# EAGLE design 0119-m328p (EAGLE 9.6.2)
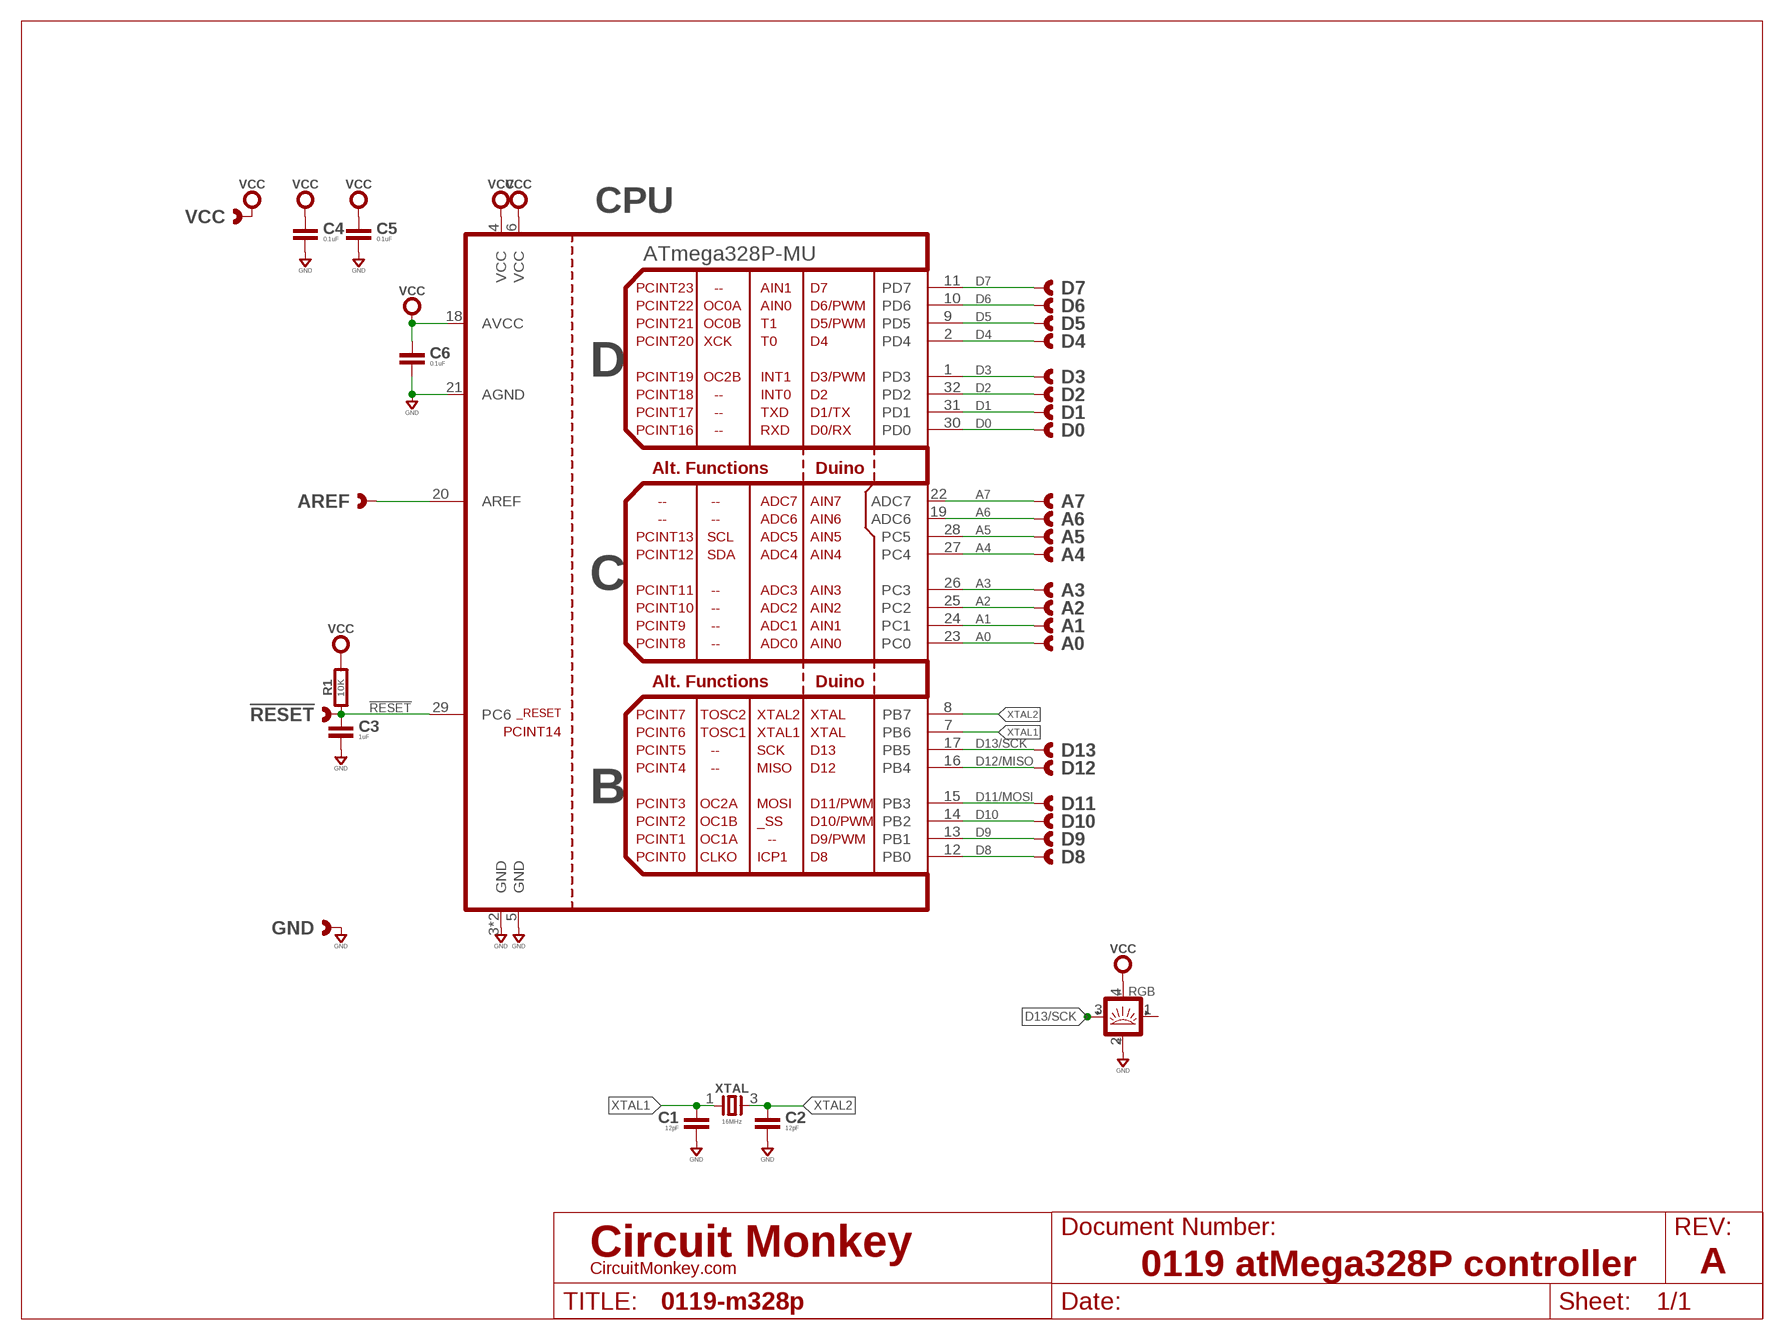
[diagram p0: schematic, sheet 1]
U$1 (LETTER_L-CIRCUITMONKEY): DOCUMENT_NUMBER: 0119 atMega328P controller; REV: A

## Parts
!RESET  CAST-01X12.00MM  [CAST01-2.00MM]
A0  CAST-01X12.00MM  [CAST01-2.00MM]
A1  CAST-01X12.00MM  [CAST01-2.00MM]
A2  CAST-01X12.00MM  [CAST01-2.00MM]
A3  CAST-01X12.00MM  [CAST01-2.00MM]
A4  CAST-01X12.00MM  [CAST01-2.00MM]
A5  CAST-01X12.00MM  [CAST01-2.00MM]
A6  CAST-01X12.00MM  [CAST01-2.00MM]
A7  CAST-01X12.00MM  [CAST01-2.00MM]
AREF  CAST-01X12.00MM  [CAST01-2.00MM]
C1  12pF  CAPACITOR0402  [0402-CAP]
C2  12pF  CAPACITOR0402  [0402-CAP]
C3  1uF  CAPACITOR0402  [0402-CAP]
C4  0.1uF  CAPACITOR0402  [0402-CAP]
C5  0.1uF  CAPACITOR0402  [0402-CAP]
C6  0.1uF  CAPACITOR0402  [0402-CAP]
CPU  ATmega328P-MU  ATMEGA328MU  [MLF32]
D0  CAST-01X12.00MM  [CAST01-2.00MM]
D1  CAST-01X12.00MM  [CAST01-2.00MM]
D2  CAST-01X12.00MM  [CAST01-2.00MM]
D3  CAST-01X12.00MM  [CAST01-2.00MM]
D4  CAST-01X12.00MM  [CAST01-2.00MM]
D5  CAST-01X12.00MM  [CAST01-2.00MM]
D6  CAST-01X12.00MM  [CAST01-2.00MM]
D7  CAST-01X12.00MM  [CAST01-2.00MM]
D8  CAST-01X12.00MM  [CAST01-2.00MM]
D9  CAST-01X12.00MM  [CAST01-2.00MM]
D10  CAST-01X12.00MM  [CAST01-2.00MM]
D11  CAST-01X12.00MM  [CAST01-2.00MM]
D12  CAST-01X12.00MM  [CAST01-2.00MM]
D13  CAST-01X12.00MM  [CAST01-2.00MM]
GND  CAST-01X12.00MM  [CAST01-2.00MM]
R1  10K  RESISTOR0402  [0402-RES]
RGB  SMART_LED2020  [SMD_2020]
VCC  CAST-01X12.00MM  [CAST01-2.00MM]
XTAL  16MHz  2P3.2X2.5  [32X25]

## Nets
!RESET: !RESET.1 !RESET.P$1 !RESET.P$2 C3.1 CPU.29(PC6) R1.1
A0: A0.1 A0.P$1 A0.P$2 CPU.23(PC0)
A1: A1.1 A1.P$1 A1.P$2 CPU.24(PC1)
A2: A2.1 A2.P$1 A2.P$2 CPU.25(PC2)
A3: A3.1 A3.P$1 A3.P$2 CPU.26(PC3)
A4: A4.1 A4.P$1 A4.P$2 CPU.27(PC4)
A5: A5.1 A5.P$1 A5.P$2 CPU.28(PC5)
A6: A6.1 A6.P$1 A6.P$2 CPU.19(ADC6)
A7: A7.1 A7.P$1 A7.P$2 CPU.22(ADC7)
D0: CPU.30(PD0) D0.1 D0.P$1 D0.P$2
D1: CPU.31(PD1) D1.1 D1.P$1 D1.P$2
D2: CPU.32(PD2) D2.1 D2.P$1 D2.P$2
D3: CPU.1(PD3) D3.1 D3.P$1 D3.P$2
D4: CPU.2(PD4) D4.1 D4.P$1 D4.P$2
D5: CPU.9(PD5) D5.1 D5.P$1 D5.P$2
D6: CPU.10(PD6) D6.1 D6.P$1 D6.P$2
D7: CPU.11(PD7) D7.1 D7.P$1 D7.P$2
D8: CPU.12(PB0) D8.1 D8.P$1 D8.P$2
D9: CPU.13(PB1) D9.1 D9.P$1 D9.P$2
D10: CPU.14(PB2) D10.1 D10.P$1 D10.P$2
D11/MOSI: CPU.15(PB3) D11.1 D11.P$1 D11.P$2
D12/MISO: CPU.16(PB4) D12.1 D12.P$1 D12.P$2
D13/SCK: CPU.17(PB5) D13.1 D13.P$1 D13.P$2 RGB.3(IN)
GND: C1.2 C2.2 C3.2 C4.2 C5.2 C6.2 CPU.3(GND) CPU.5(GND) CPU.21(AGND) CPU.PAD(GND) GND.1 GND.P$1 GND.P$2 RGB.2(GND)
N$2: AREF.1 AREF.P$1 AREF.P$2 CPU.20(AREF)
VCC: C4.1 C5.1 C6.1 CPU.4(VCC) CPU.6(VCC) CPU.18(AVCC) R1.2 RGB.4(VDD) VCC.1 VCC.P$1 VCC.P$2
XTAL1: C1.1 CPU.7(PB6) XTAL.1
XTAL2: C2.1 CPU.8(PB7) XTAL.3
Unconnected: RGB.1(OUT)

## Library data of the parts
!RESET A0 A1-A7 AREF D0 D1-D13 GND VCC = con-headers:CAST-01X1: Castelated Edge Hole Pad
C1-C6 = rlc:CAPACITOR: Capacitor
CPU = atmel-atmega:ATMEGA328: Atmega 328P; MFR: Atmel; MPN: atmega328p-mu; OC_MOUSER: 556-ATMEGA328P-MU; OC_SEEED: 310010005
R1 = rlc:RESISTOR: Resistor
RGB = led:SMART_LED: Smart LED SK6812 WS2812
XTAL = xtal:2P: Crystal; MF: Epson; MPN: FA-238 16.0000MB-K3

## Board
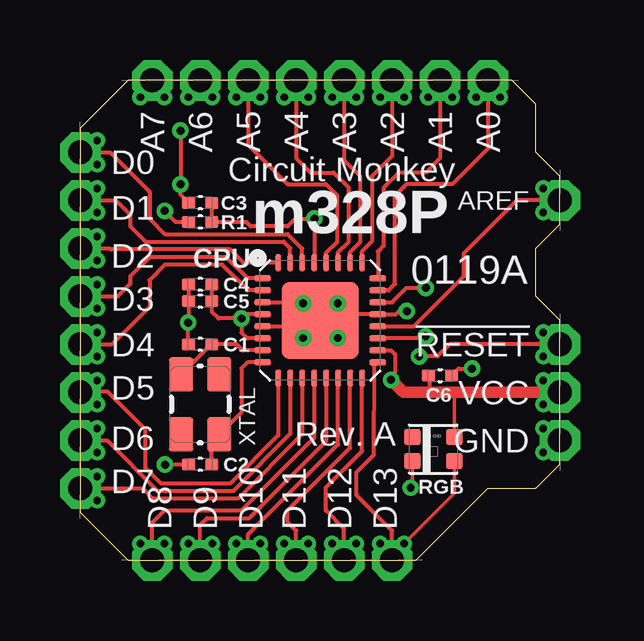
[diagram p1: board, top side]
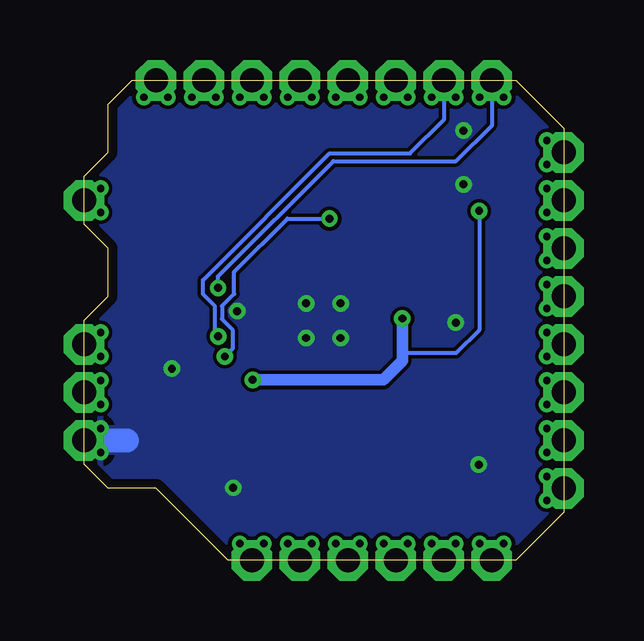
[diagram p2: board, bottom side, seen from below]

Size 20 x 20 mm. Coordinates in mm from the lower left corner, seen from the top.
Outline: 2,0 14,0 17,3 19,3 20,4 20,10 19,11 19,13 20,14 20,16 19,17 19,19 18,20 2,20 0,18 0,2 2,0
Copper layers (1*16): Top 0.0356mm / dielectric 1.5011mm / Bottom 0.0356mm
Design rules "OSH-CircuitMonkey *": minimum track width 6mil, minimum drill 12mil, track to track 6mil, track to pad 6mil, pad to pad 6mil, via to via 6mil, smd to smd 6mil, copper to edge 15mil, drill to drill 6mil, minimum pad ring 7mil, minimum via ring 7mil, stop-mask expansion 3mil, vias tented up to drill 13mil, thermal gap 10mil

### Footprints (pad centres in the part's own frame; a part is rotated, then mirrored left to right if it is on the bottom)
CAST01-2.00MM = drill 1 pad 1.7 octagon: 1 0,0 | drill 0.305: P$1 -0.7,0.5; P$2 -0.7,-0.5
0402-CAP = smd 0.559 x 0.508: 1 -0.483,0; 2 0.483,0
MLF32 = smd 0.7 x 0.25: 1 -2.4,1.75; 2 -2.4,1.25; 3 -2.4,0.75; 4 -2.4,0.25; 5 -2.4,-0.25; 6 -2.4,-0.75; 7 -2.4,-1.25; 8 -2.4,-1.75; 17 2.4,-1.75; 18 2.4,-1.25; 19 2.4,-0.75; 20 2.4,-0.25; 21 2.4,0.25; 22 2.4,0.75; 23 2.4,1.25; 24 2.4,1.75 | smd 0.25 x 0.7: 9 -1.75,-2.4; 10 -1.25,-2.4; 11 -0.75,-2.4; 12 -0.25,-2.4; 13 0.25,-2.4; 14 0.75,-2.4; 15 1.25,-2.4; 16 1.75,-2.4; 25 1.75,2.4; 26 1.25,2.4; 27 0.75,2.4; 28 0.25,2.4; 29 -0.25,2.4; 30 -0.75,2.4; 31 -1.25,2.4; 32 -1.75,2.4 | smd 3.2 x 3.2: PAD 0,0
0402-RES = smd 0.559 x 0.508: 1 -0.483,0; 2 0.483,0
SMD_2020 = smd 0.7 x 0.66: 1 -0.88,0.5; 2 -0.88,-0.5; 3 0.88,-0.5; 4 0.88,0.5
32X25 = smd 1.4 x 1: 1 -1.25,-0.8; 2 1.25,-0.8; 3 1.25,0.8; 4 -1.25,0.8

### Placement (x,y rotation side)
!RESET  20,9 0 top
A0  17,20 90 top
A1  15,20 90 top
A2  13,20 90 top
A3  11,20 90 top
A4  9,20 90 top
A5  7,20 90 top
A6  5,20 90 top
A7  3,20 90 top
AREF  20,15 0 top
C1  5,9 180 top
C2  5,4 180 top
C3  5,14.9 180 top
C4  5,11.5 180 top
C5  5,10.8 180 top
C6  15,7.7 0 top
CPU  10,10 0 top
D0  0,17 180 top
D1  0,15 180 top
D2  0,13 180 top
D3  0,11 180 top
D4  0,9 180 top
D5  0,7 180 top
D6  0,5 180 top
D7  0,3 180 top
D8  3,0 270 top
D9  5,0 270 top
D10  7,0 270 top
D11  9,0 270 top
D12  11,0 270 top
D13  13,0 270 top
GND  20,5 0 top
R1  5,14.1 180 top
RGB  14.72,4.64 0 top
VCC  20,7 0 top
XTAL  5,6.5 270 top

### Tracks (layer width: path | path; a pad name or v marks a point on that pad's centre or on a via)
!RESET  (via drill 0.33)
  Top 0.16: C3.1 R1.1 6.92,14.1 7.1,13.92 8.64,13.92 8.96,14.24 v9.76,14.24 CPU.29 | v14.12,8.5 14.9,8.5 15.4,9 !RESET.1 19.8,9 | 19.8,9 !RESET.P$2 | 19.8,9 !RESET.P$1
  Bottom 0.16: v14.12,8.5 13.8,8.82 13.8,9.62 14.24,10.05 14.24,10.6 13.74,11.1 13.74,12.02 11.52,14.24 v9.76,14.24
A0
  Top 0.16: CPU.23 12.85,11.25 13.12,11.52 13.12,15.2 13.6,15.68 15.52,15.68 17,17.16 A0.1 | A0.1 17.5,19.5 A0.P$2 | A0.1 17,19.8 A0.P$1
A1
  Top 0.16: CPU.24 12.4,12.87 12.64,13.11 12.64,15.52 13.28,16.16 14.4,16.16 15,16.76 A1.1 15,19.8 | 15,19.8 A1.P$2 | 15,19.8 A1.P$1
A2
  Top 0.16: CPU.25 11.75,12.88 12.16,13.29 12.16,16 13,16.84 A2.1 13,19.8 | 13,19.8 A2.P$2 | 13,19.8 A2.P$1
A3
  Top 0.16: CPU.26 11.25,12.85 11.68,13.28 11.68,16 11,16.68 A3.1 11,19.8 | 11,19.8 A3.P$2 | 11,19.8 A3.P$1
A4
  Top 0.16: CPU.27 10.75,12.83 11.2,13.28 11.2,15.52 10.56,16.16 9.6,16.16 9,16.76 A4.1 9,19.8 | 9,19.8 A4.P$2 | 9,19.8 A4.P$1
A5
  Top 0.16: CPU.28 10.25,12.81 10.72,13.28 10.72,15.2 10.24,15.68 8.64,15.68 7,17.32 A5.1 7,19.8 | 7,19.8 A5.P$2 | 7,19.8 A5.P$1
A6  (via drill 0.33)
  Top 0.16: v14.4,9.34 14.31,9.25 CPU.19 | 5,19.8 A6.P$2 | A6.1 5,19.8 | 5,19.8 A6.P$1
  Bottom 0.16: v14.4,9.34 14.56,9.49 14.56,10.62 15.04,11.1 15.04,11.68 9.76,16.96 6.4,16.96 5,18.36 A6.1
A7  (via drill 0.33)
  Top 0.16: CPU.22 13,10.75 13.61,11.35 v14.41,11.35 | 3,19.8 A7.P$2 | A7.1 3,19.8 | 3,19.8 A7.P$1
  Bottom 0.16: v14.41,11.35 14.41,11.83 9.6,16.64 4.48,16.64 3,18.12 A7.1
D0
  Top 0.16: CPU.30 9.25,12.99 8.64,13.6 3.52,13.6 2.88,14.24 2.88,15.36 1.24,17 D0.1 | D0.1 0.04,17 0.54,16.5 D0.P$1 | D0.1 0.2,17 D0.P$2
D1
  Top 0.16: CPU.31 8.75,13.01 8.48,13.28 2.72,13.28 2.08,13.92 2.08,14.4 1.48,15 D1.1 0.2,15 | 0.2,15 D1.P$2 | 0.2,15 D1.P$1
D2
  Top 0.16: CPU.32 6.8,12.4 6.24,12.96 1.28,12.96 1.24,13 D2.1 0.2,13 | 0.2,13 D2.P$2 | 0.2,13 D2.P$1
D3
  Top 0.16: CPU.1 6.97,11.75 6.08,12.64 2.88,12.64 2.08,11.84 2.08,11.52 1.56,11 D3.1 0.2,11 | 0.2,11 D3.P$2 | 0.2,11 D3.P$1
D4
  Top 0.16: CPU.2 6.99,11.25 5.92,12.32 3.52,12.32 2.88,11.68 2.88,10.56 1.32,9 D4.1 0.2,9 | 0.2,9 D4.P$2 | 0.2,9 D4.P$1
D5
  Top 0.16: CPU.9 8.25,5.21 6.24,3.2 3.36,3.2 2.72,3.84 2.72,5.44 1.12,7.04 0.04,7.04 D5.1 | D5.1 0.5,7.5 D5.P$2 | D5.1 0.2,7 D5.P$1
D6
  Top 0.16: CPU.10 8.75,5.27 6.37,2.89 3.23,2.89 1.12,5 D6.1 0.2,5 | 0.2,5 D6.P$2 | 0.2,5 D6.P$1
D7
  Top 0.16: CPU.11 9.25,5.25 6.58,2.58 3.02,2.58 2.6,3 D7.1 0.2,3 | 0.2,3 D7.P$2 | 0.2,3 D7.P$1
D8
  Top 0.16: CPU.12 9.75,5.11 6.72,2.08 3.52,2.08 3,1.56 D8.1 | D8.1 3,0.16 2.5,0.66 D8.P$2 | D8.1 3,0.2 D8.P$1
D9
  Top 0.16: CPU.13 10.25,4.97 7.04,1.76 5.28,1.76 5,1.48 D9.1 5,0.2 | 5,0.2 D9.P$2 | 5,0.2 D9.P$1
D10
  Top 0.16: CPU.14 10.75,4.83 7,1.08 D10.1 7,0.2 | 7,0.2 D10.P$2 | 7,0.2 D10.P$1
D11/MOSI
  Top 0.16: CPU.15 11.25,4.69 8.64,2.08 8.64,1.6 9,1.24 D11.1 9,0.2 | 9,0.2 D11.P$2 | 9,0.2 D11.P$1
D12/MISO
  Top 0.16: CPU.16 11.75,4.55 10.24,3.04 10.24,2.08 11,1.32 D12.1 11,0.2 | 11,0.2 D12.P$2 | 11,0.2 D12.P$1
D13/SCK
  Top 0.152: RGB.3 15.6,2.8 D13.P$1
  Top 0.16: CPU.17 12.24,8.09 12.23,4.39 11.52,3.68 11.52,2.72 13,1.24 D13.1 13,0.2 | 13,0.2 D13.P$2 | 13,0.2 D13.P$1
GND  (via drill 0.33)
  Top 0.152: RGB.2 13.84,3.09 v13.77,3.03
  Top 0.16: v13.61,10.39 13.29,10.39 13.16,10.25 CPU.21 11.01,10.25 10.76,10 10.08,10 | 10.08,10 CPU.PAD 9.24,10 8.99,9.75 CPU.5 | CPU.3 9.33,10.75 10.08,10 | C4.2 C5.2 4.52,9.94 v4.49,9.92 v4.49,9.91 4.49,9.02 C1.2 | C3.2 4.17,15.24 v4.17,15.67 v4.17,17.91 | C6.2 15.77,7.99 v16.33,7.99 | C2.2 4.5,3.99 v3.53,3.99
  Bottom 0.152: 19.8,5 GND.P$1 | GND.1 19.8,5 | 19.8,5 GND.P$2
  Bottom 1: GND.1 18.2,5
  other vias: 9.29,10.71 10.73,10.71 10.73,9.27 9.29,9.27
  pour Bottom (rank 5): 0.1,18.1 2,20 18,20 20,18 20,14 19,13 19,11 20,10 20,4 19,3 17,3 14,0 2,0 0.1,1.9
N$2
  Top 0.16: CPU.20 13.91,9.75 16,11.84 16,12.8 18.2,15 AREF.1 19.8,15 | 19.8,15 AREF.P$2 | 19.8,15 AREF.P$1
VCC  (via drill 0.33)
  Top 0.152: RGB.4 15.6,6.92 15.68,7
  Top 0.16: CPU.18 12.96,8.75 13.12,8.59 13.12,7.84 12.96,7.68 v12.96,7.52 | C4.1 C5.1 5.48,10.36 5.76,10.08 v6.72,10.08 | CPU.6 6.96,9.25 6.72,9.49 v6.72,10.08 | CPU.4 6.89,10.25 v6.72,10.08 | R1.2 3.98,14.1 v3.52,14.56 | C6.1 14.56,7.66 14.56,7 | 19.8,7 VCC.P$1 | VCC.1 19.8,7 | 19.8,7 VCC.P$2
  Top 0.48: VCC.1 15.68,7 14.56,7 13.48,7 v12.96,7.52
  Bottom 0.16: v3.52,14.56 3.52,9.6 4.48,8.64 6.72,8.64
  Bottom 0.48: v12.96,7.52 7.52,7.52 6.72,8.32 6.72,8.64 v6.72,10.08
XTAL1
  Top 0.16: XTAL.1 5.45,9 C1.1 6.52,9 6.77,8.75 CPU.7
XTAL2
  Top 0.16: C2.1 5.48,4.93 XTAL.3 6.72,6.17 6.72,8 6.97,8.25 CPU.8

### Text on the board
tPlace: Circuit Monkey | m328P | 0119A | Rev. A